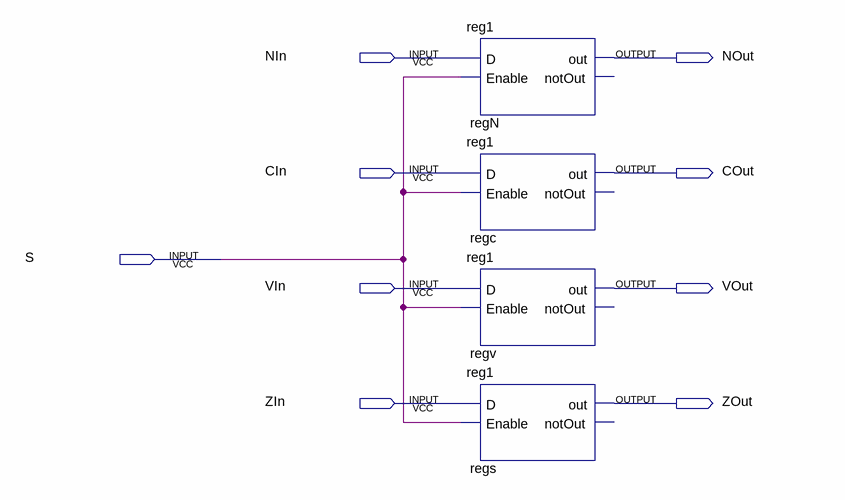
[diagram p0: schematic sheet]
// Quartus schematic PS.bdf as structural Verilog: 4 symbols, 9 pins
module PS (
  input  NIn,
  input  CIn,
  input  S,
  input  VIn,
  input  ZIn,
  output NOut,
  output COut,
  output VOut,
  output ZOut
);

  reg1 regN (.D(NIn), .Enable(S), .out(NOut));  // open: notOut
  reg1 regc (.D(CIn), .Enable(S), .out(COut));  // open: notOut
  reg1 regv (.D(VIn), .Enable(S), .out(VOut));  // open: notOut
  reg1 regs (.D(ZIn), .Enable(S), .out(ZOut));  // open: notOut
endmodule
